# Altium schematic sheet Connectors.SchDoc
size 420 x 297 mm; DocumentNumber: Connectors
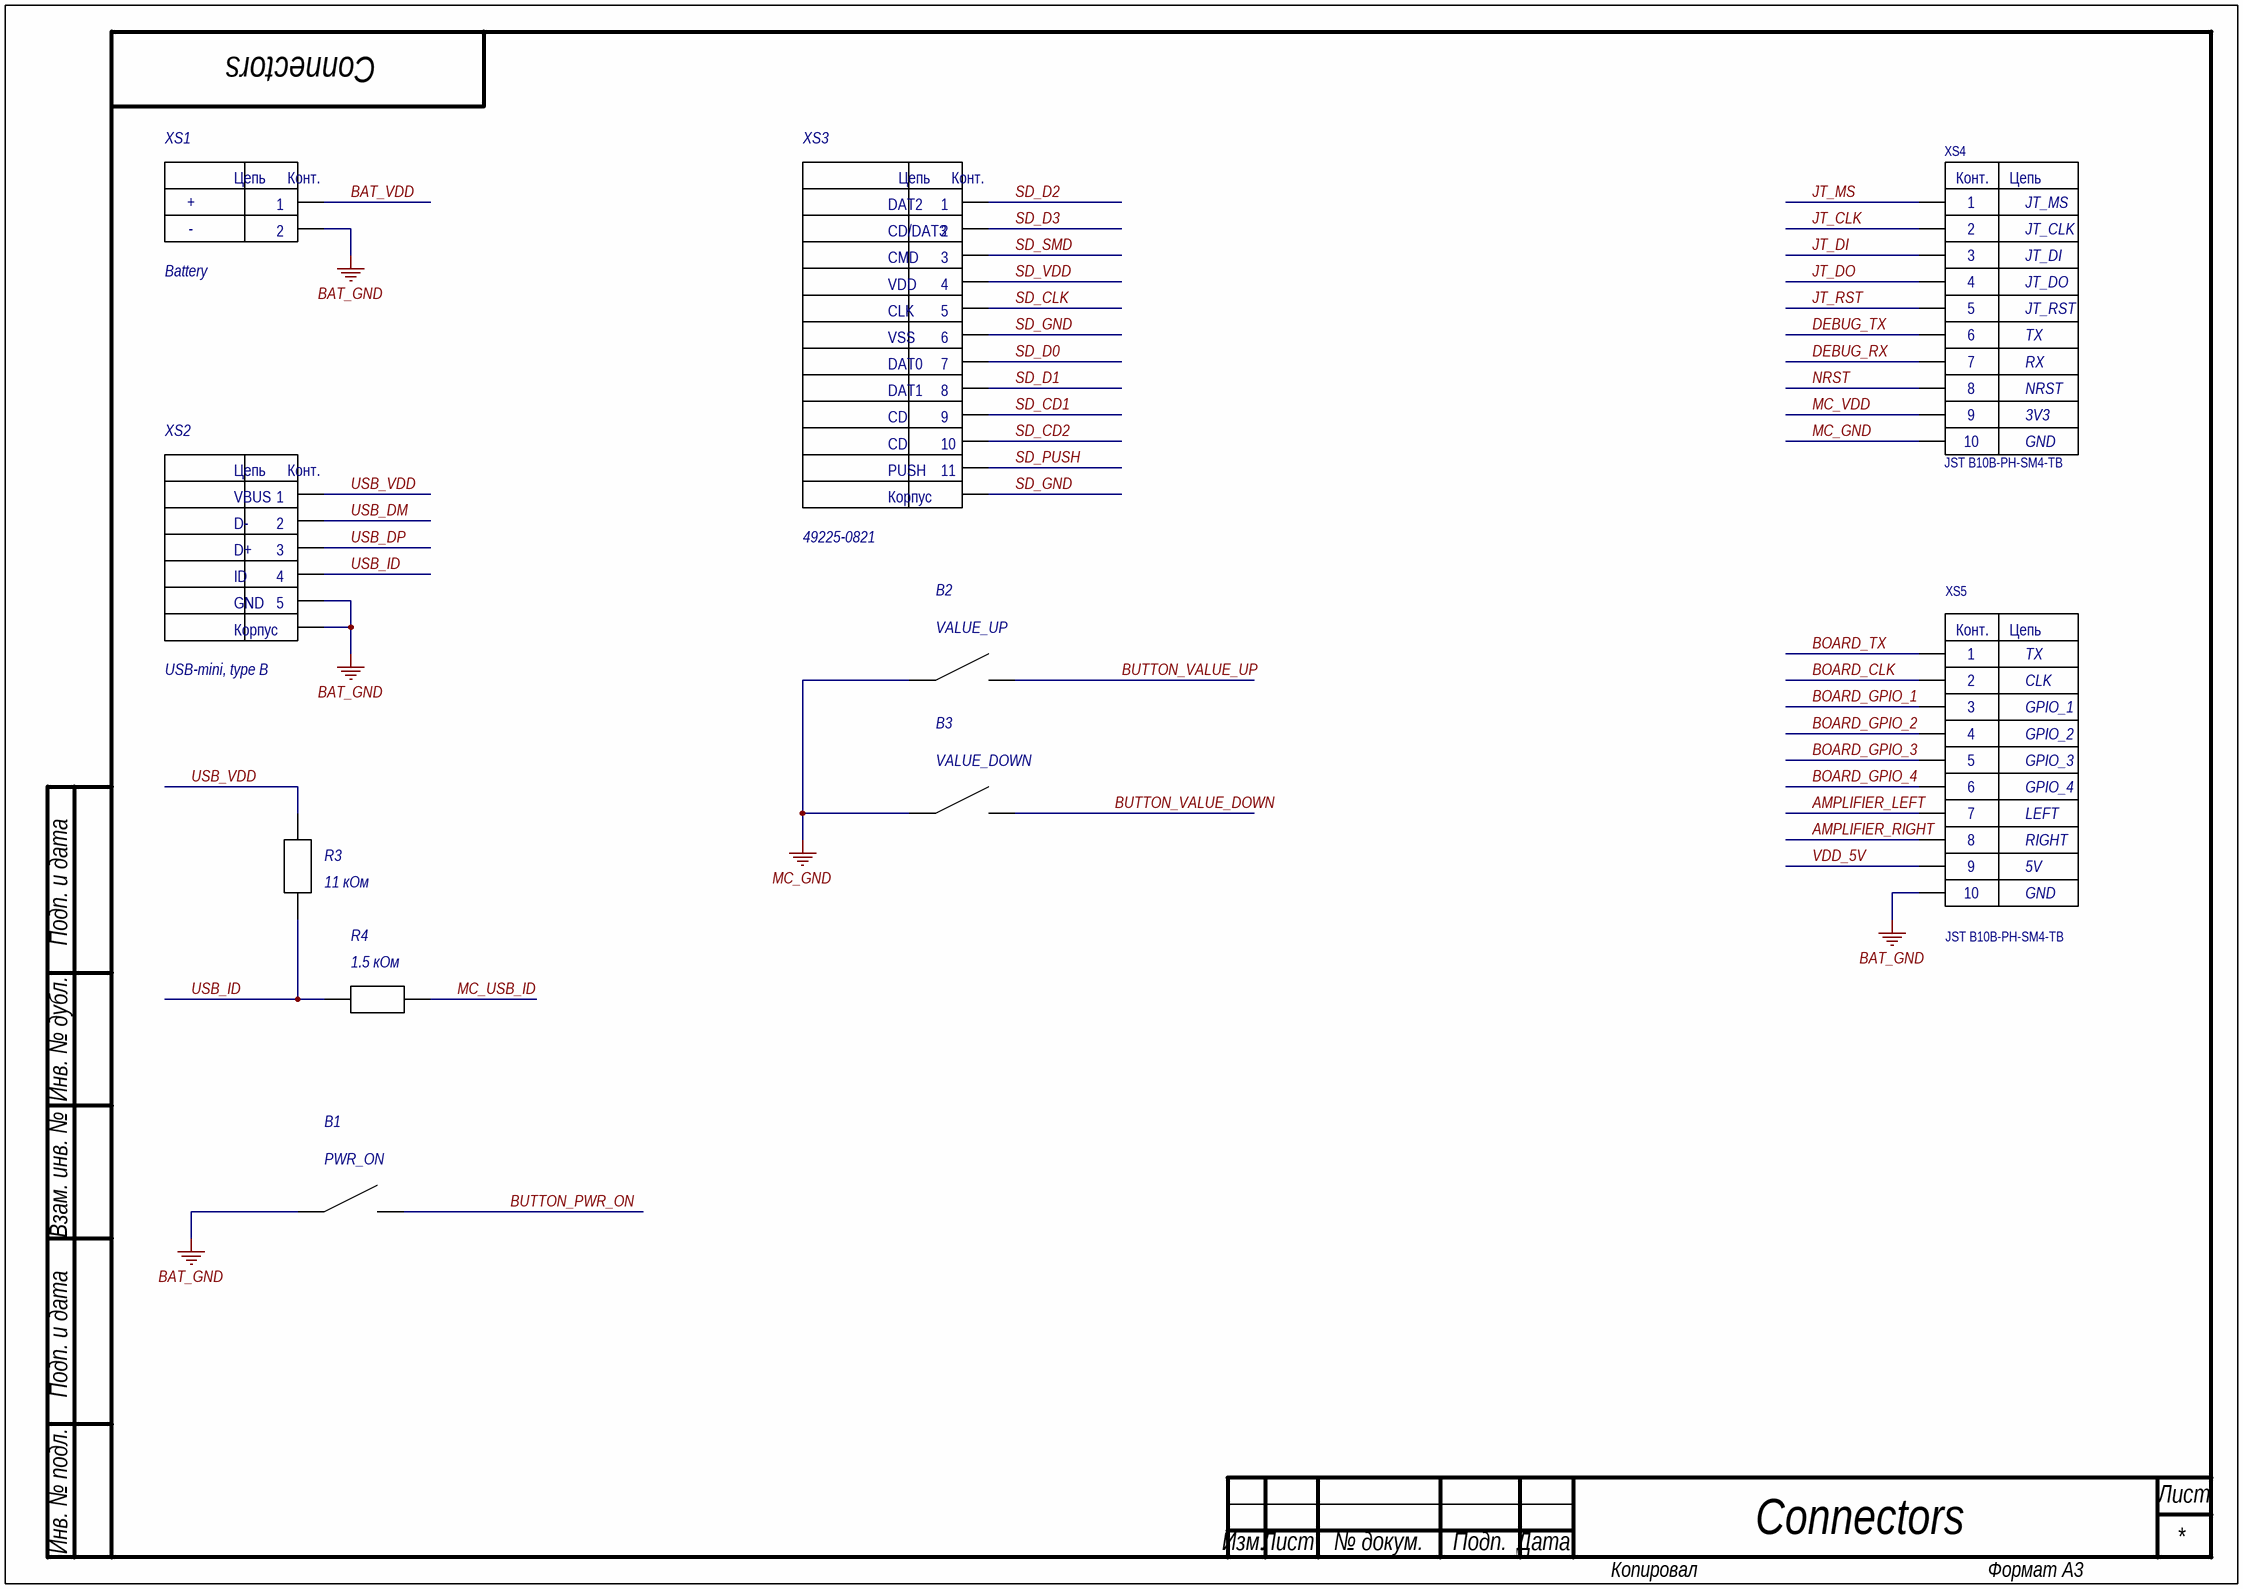
[diagram p0: Connectors.SchDoc]

## Parts
B1  BUTTON  [TACT SKHH Horizontal Switch]  (value not drawn)
B2  BUTTON  [TACT SKHH Horizontal Switch]  (value not drawn)
B3  BUTTON  [TACT SKHH Horizontal Switch]  (value not drawn)
R3  11 кОм  [RES 0402]
R4  1.5 кОм  [RES 0402]
XS1  Battery  [JST B2B-PH-SM4-TB]
XS2  USB-mini, type B  [USB_mini_B]
XS3  49225-0821  [MOLEX 49225-0821]
XS4  JST B10B-PH-SM4-TB  [B10B-PH-SM4-TB]
XS5  JST B10B-PH-SM4-TB  [B10B-PH-SM4-TB]

## Nets
BAT_GND: B1.1 XS1.2 XS2.0 XS2.5(GND) XS5.10
MC_GND: B2.1 B3.1 XS4.10
AMPLIFIER_LEFT: XS5.7
AMPLIFIER_RIGHT: XS5.8
BAT_VDD: XS1.1
BOARD_CLK: XS5.2
BOARD_GPIO_1: XS5.3
BOARD_GPIO_2: XS5.4
BOARD_GPIO_3: XS5.5
BOARD_GPIO_4: XS5.6
BOARD_TX: XS5.1
BUTTON_PWR_ON: B1.2
BUTTON_VALUE_DOWN: B3.2
BUTTON_VALUE_UP: B2.2
DEBUG_RX: XS4.7
DEBUG_TX: XS4.6
JT_CLK: XS4.2
JT_DI: XS4.3
JT_DO: XS4.4
JT_MS: XS4.1
JT_RST: XS4.5
MC_USB_ID: R4.1
MC_VDD: XS4.9
NRST: XS4.8
SD_CD1: XS3.9
SD_CD2: XS3.10
SD_CLK: XS3.5
SD_D0: XS3.7
SD_D1: XS3.8
SD_D2: XS3.1
SD_D3: XS3.2
SD_GND: XS3.0 XS3.6
SD_PUSH: XS3.11
SD_SMD: XS3.3
SD_VDD: XS3.4
USB_DM: XS2.2(D-)
USB_DP: XS2.3(D+)
USB_ID: R3.1 R4.2 XS2.4(CASE)
USB_VDD: R3.2 XS2.1(VBUS)
VDD_5V: XS5.9

## Notes on the sheet
- +
- -
- JT_CLK
- JT_MS
- JT_DI
- JT_RST
- JT_DO
- TX
- NRST
- RX
- 3V3
- GND
- (near B2) VALUE_UP
- CLK
- GPIO_1
- GPIO_2
- (near B3) VALUE_DOWN
- GPIO_3
- GPIO_4
- LEFT
- RIGHT
- 5V
- (near B1) PWR_ON
- Подп. и дата
- Инв. № дубл.
- Взам. инв. №
- Инв. № подл.
- Лист
- Изм.
- № докум.
- Подп.
- Дата
- Копировал
- Формат А3
- (in symbol 49225-0821) Цепь; Конт.; DAT2; CD/DAT3; CMD; VDD; CLK; VSS; DAT0; DAT1; CD; PUSH; Корпус
- (in symbol JST B2B-PH-SM4-TB) Цепь; Конт.
- (in symbol JST B10B-PH-SM4-TB) Конт.; Цепь
- (in symbol USB-mini_B) Цепь; Конт.; ID; Корпус

## Library data of the parts
R3 R4 = RES 0402
XS1 = JST B2B-PH-SM4-TB
XS2 = USB-mini_B: USB-mini-B connector; Manufacturer: NONAME; Connector type: USB-mini, тип B на плату; Number of contacts: 5; Type: Разъем
XS3 = 49225-0821: MOLEX MicroSD connector; Connector type: Разъем MicroSD на плату; Number of contacts: 11; Manufacturer: Molex; Type: Разъем
XS4 XS5 = JST B10B-PH-SM4-TB: PLS connector; Manufacturer: NONAME; Connector type: Вилка на плату; Number of contacts: 10; Type: Разъем штыревой